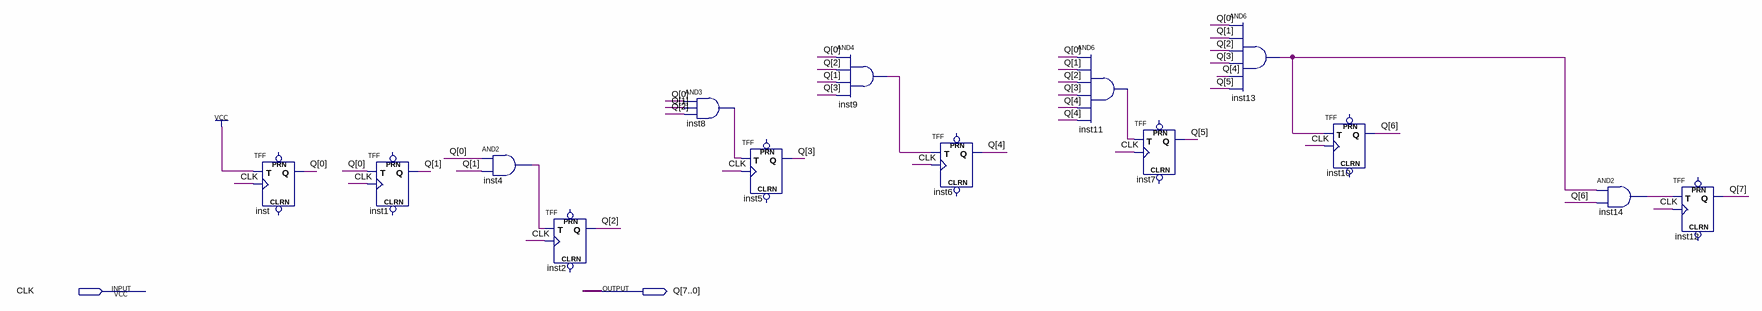
[diagram p0: schematic sheet]
// Quartus schematic Aula4.bdf as structural Verilog: 14 symbols, 2 pins
module Aula4 (
  input  CLK,
  output [7:0] Q
);

  wire inst4_out, inst8_out, inst9_out, inst11_out, inst13_out, inst14_out;

  TFF inst (.T(1'b1), .CLK(CLK), .Q(Q[0]));  // open: PRN, CLRN
  TFF inst1 (.T(Q[0]), .CLK(CLK), .Q(Q[1]));  // open: PRN, CLRN
  and inst4 (inst4_out, Q[0], Q[1]);
  TFF inst2 (.T(inst4_out), .CLK(CLK), .Q(Q[2]));  // open: PRN, CLRN
  and inst8 (inst8_out, Q[0], Q[1], Q[2]);
  TFF inst5 (.T(inst8_out), .CLK(CLK), .Q(Q[3]));  // open: PRN, CLRN
  and inst9 (inst9_out, Q[0], Q[2], Q[1], Q[3]);
  TFF inst6 (.T(inst9_out), .CLK(CLK), .Q(Q[4]));  // open: PRN, CLRN
  and inst11 (inst11_out, Q[0], Q[1], Q[2], Q[3], Q[4], Q[4]);
  TFF inst7 (.T(inst11_out), .CLK(CLK), .Q(Q[5]));  // open: PRN, CLRN
  and inst13 (inst13_out, Q[0], Q[1], Q[2], Q[3], Q[4], Q[5]);
  TFF inst10 (.T(inst13_out), .CLK(CLK), .Q(Q[6]));  // open: PRN, CLRN
  and inst14 (inst14_out, inst13_out, Q[6]);
  TFF inst12 (.T(inst14_out), .CLK(CLK), .Q(Q[7]));  // open: PRN, CLRN
endmodule
